# Altium schematic sheet recv_board.SchDoc
size A3; SheetNumber: 5; SheetTotal: 6
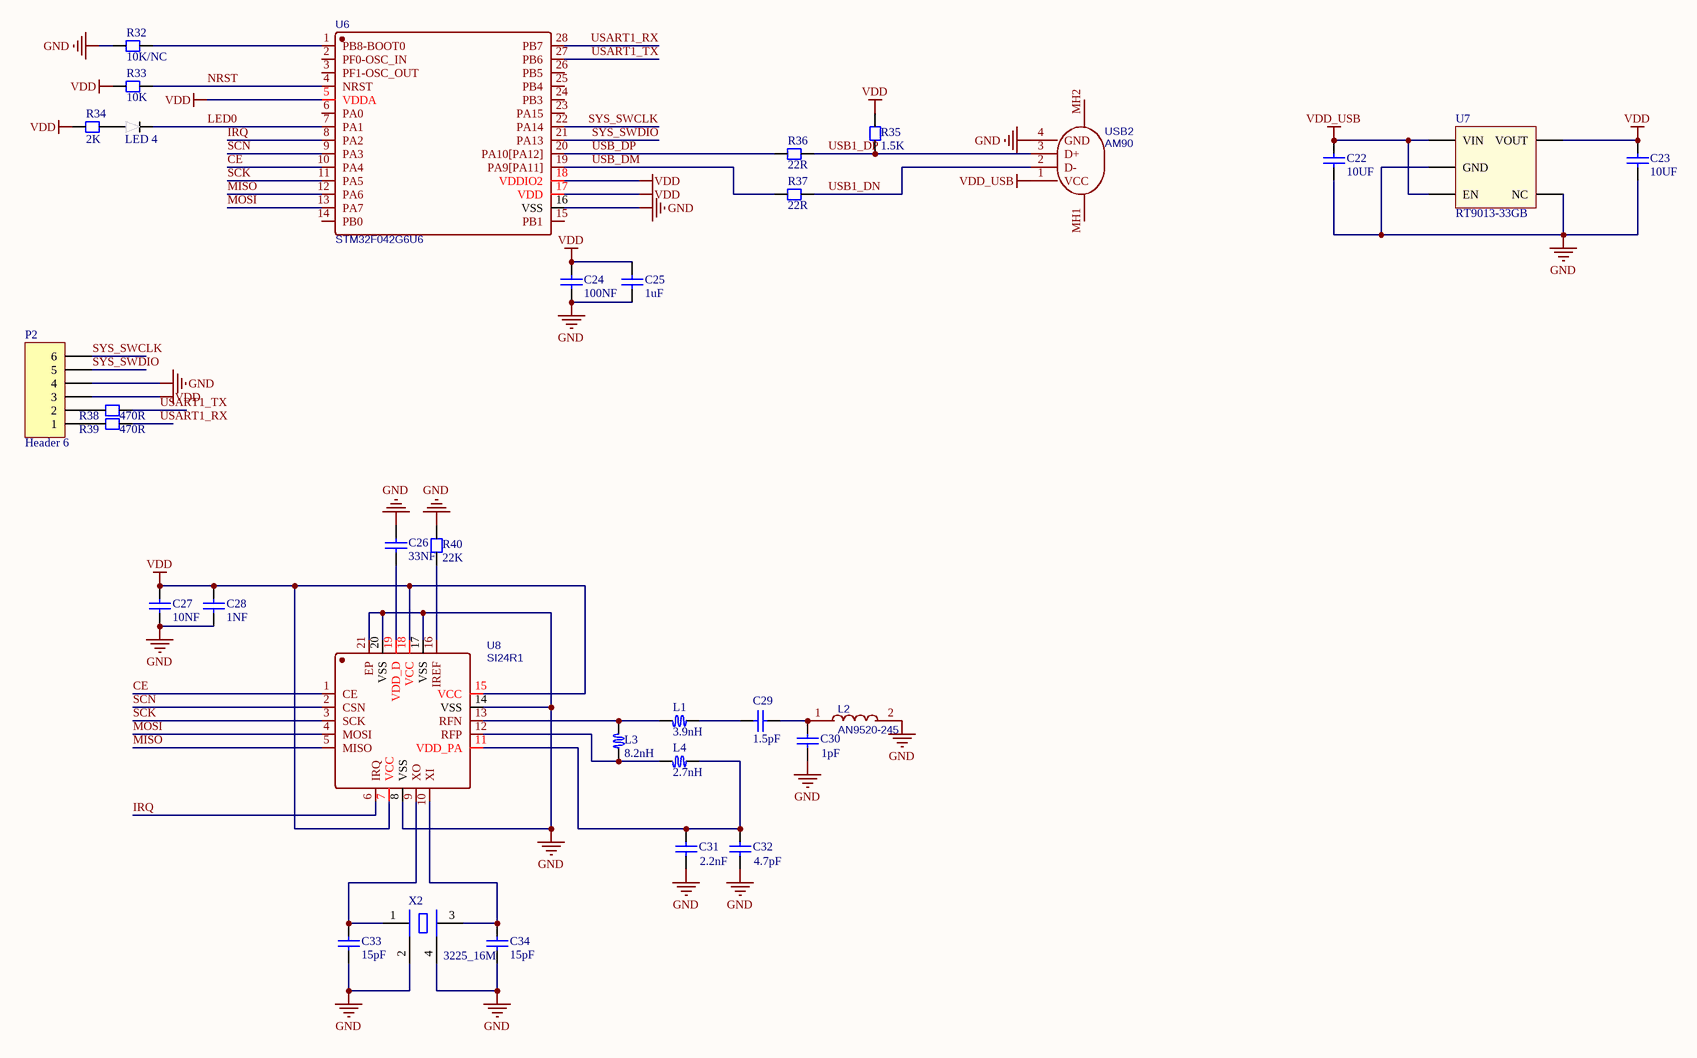
[diagram p0: recv_board.SchDoc]

## Parts
C22  10UF  [CC1608-0603]
C23  10UF  [CC1608-0603]
C24  100NF  [CC1608-0603]
C25  1uF  [CC1608-0603]
C26  33NF  [CC1608-0603]
C27  10NF  [CC1608-0603]
C28  1NF  [CC1608-0603]
C29  1.5pF  [CC1608-0603]
C30  1pF  [CC1608-0603]
C31  2.2nF  [CC1608-0603]
C32  4.7pF  [CC1608-0603]
C33  15pF  [CC1608-0603]
C34  15pF  [CC1608-0603]
L1  3.9nH  [Inductor-0603]
L2  AN9520-245  [ANT-SMD_L9.5-W2.1]
L3  8.2nH  [Inductor-0603]
L4  2.7nH  [Inductor-0603]
LED_4  LED 0603  [LED 0603]  (value not drawn)
P2  Header 6  [HDR1X6]
R32  10K/NC  [CR1608-0603]
R33  10K  [CR1608-0603]
R34  2K  [CR1608-0603]
R35  1.5K  [CR1608-0603]
R36  22R  [CR1608-0603]
R37  22R  [CR1608-0603]
R38  470R  [CR1608-0603]
R39  470R  [CR1608-0603]
R40  22K  [CR1608-0603]
U6  STM32F042G6U6  [UFQFPN-28]
U7  RT9013-33GB  [SOT23-5]
U8  SI24R1  [QFN-20]
USB2  AM90  [USB-AM]
X2  3225_16M  [XTAL-3225]

## Nets
GND: C22.1 C23.1 C24.1 C25.1 C26.2 C27.1 C28.1 C30.2 C31.2 C32.2 C33.1 C34.1 L2.2 P2.4 R32.1 R40.1 U6.16(VSS) U7.2(GND) U7.4(NC) U8.8(VSS) U8.14(VSS) U8.17(VSS) U8.20(VSS) U8.21(EP) USB2.4(GND) X2.2(GND) X2.4(GND)
VDD: C23.2 C24.2 C25.2 C27.2 C28.2 P2.3 R33.2 R34.2 R35.1 U6.5(VDDA) U6.17(VDD) U6.18(VDDIO2) U7.5(VOUT) U8.7(VCC) U8.15(VCC) U8.18(VCC)
VDD_USB: C22.2 U7.1(VIN) U7.3(EN) USB2.1(VCC)
CE: U6.10(PA4) U8.1(CE)
IRQ: U6.8(PA2) U8.6(IRQ)
LED0: LED_4.2 U6.7(PA1)
MISO: U6.12(PA6) U8.5(MISO)
MOSI: U6.13(PA7) U8.4(MOSI)
NRST: R33.1 U6.4(NRST)
SCK: U6.11(PA5) U8.3(SCK)
SCN: U6.9(PA3) U8.2(CSN)
SYS_SWCLK: P2.6 U6.22(PA14)
SYS_SWDIO: P2.5 U6.21(PA13)
USART1_RX: R39.1 U6.28(PB7)
USART1_TX: R38.1 U6.27(PB6)
USB1_DN: R37.1 USB2.2(D-)
USB1_DP: R35.2 R36.1 USB2.3(D+)
USB_DM: R37.2 U6.19(PA9[PA11])
USB_DP: R36.2 U6.20(PA10[PA12])
NetC26_1: C26.1 U8.19(VDD_D)
NetC29_1: C29.1 C30.1 L2.1
NetC29_2: C29.2 L1.1
NetC31_1: C31.1 C32.1 L4.1 U8.11(VDD_PA)
NetC33_2: C33.2 U8.9(XO) X2.1(OSC1)
NetC34_2: C34.2 U8.10(XI) X2.3(OSC2)
NetL1_2: L1.2 L3.2 U8.13(RFN)
NetL3_1: L3.1 L4.2 U8.12(RFP)
NetLED_4_1: LED_4.1 R34.1
NetP2_1: P2.1 R39.2
NetP2_2: P2.2 R38.2
NetR32_2: R32.2 U6.1(PB8-BOOT0)
NetR40_2: R40.2 U8.16(IREF)

Not connected (* = marked no-connect by the designer): U6 2(PF0-OSC_IN) 3(PF1-OSC_OUT) 6(PA0) 14(PB0) 15(PB1) 23(PA15) 24(PB3) 25(PB4) 26(PB5); USB2 MH1 MH2

## Library data of the parts
C22-C34 = Cap Chip 0603: 0603封装的电容; Published: 8-Jun-2000; Revision: July-2002: Re-released for DXP Platform.; Publisher: Altium Limited
L1 L3 L4 = Inductor-0603: 贴片电感 0603封装
L2 = AN9520-245: Manufacturer: rainsun(霖昱微); Supplier: LCSC; Manufacturer Part: AN9520-245; Supplier Part: C99665; JLCPCB Part Class: Extended Part; spicePre: L; spiceSymbolName: AN9520-245
P2 = Header 6: Header, 6-Pin; LatestRevisionDate: 17-Jul-2002; LatestRevisionNote: Re-released for DXP Platform.; Publisher: Altium Limited
R32-R37 R40 = Resistor Chip 0603: 0603封装电阻; Published: 8-Jun-2000; Revision: July-2002: Re-released for DXP Platform.; Publisher: Altium Limited
R38 R39 = Chip resistor: 贴片电阻
U6 = STM32F042G6U6: Manufacturer: ST(意法半导体); Contributor: LCSC; Supplier: LCSC; Supplier Part: C961597; Manufacturer Part: STM32F042G6U6; JLCPCB Part Class: Extended Part; spicePre: U; spiceSymbolName: STM32F042G6U6
U7 = RT9013-33GB: LDO 2.2-5.2V IN 500Ma OUT SOT23-5
U8 = SI24R1: Manufacturer: 南京中科微; nameAlias: Value; Supplier: LCSC; Manufacturer Part: Si24R1; Supplier Part: C14436; JLCPCB Part Class: Extended Part; spicePre: U; spiceSymbolName: Si24R1
USB2 = USB-AM90: Manufacturer: SHOU HAN(首韩); Contributor: LCSC; Supplier: LCSC; Supplier Part: C404965; Manufacturer Part: AM90; JLCPCB Part Class: Extended Part; spicePre: U; spiceSymbolName: AM90
X2 = XTAL 3225: 3225封装的晶振